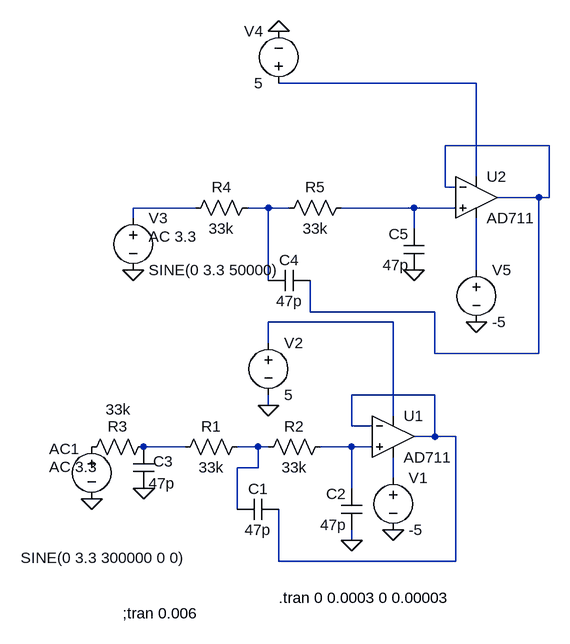
[diagram p0: schematic Sallen Key Filter Sim.asc]
Sallen Key Filter Sim.asc, the LTspice schematic file:
Version 4
SHEET 1 880 680
WIRE 320 -368 16 -368
WIRE 432 -272 272 -272
WIRE 320 -224 320 -368
WIRE 272 -208 272 -272
WIRE 288 -208 272 -208
WIRE 416 -192 352 -192
WIRE 432 -192 432 -272
WIRE 432 -192 416 -192
WIRE -112 -176 -208 -176
WIRE 0 -176 -32 -176
WIRE 32 -176 0 -176
WIRE 224 -176 112 -176
WIRE 288 -176 224 -176
WIRE -208 -160 -208 -176
WIRE 224 -144 224 -176
WIRE 320 -80 320 -160
WIRE 0 -64 0 -176
WIRE 64 -16 64 -64
WIRE 256 -16 64 -16
WIRE 192 0 0 0
WIRE 0 32 0 0
WIRE 256 48 256 -16
WIRE 416 48 416 -192
WIRE 416 48 256 48
WIRE 256 112 128 112
WIRE 0 128 0 112
WIRE 192 144 192 0
WIRE 128 160 128 112
WIRE 160 160 128 160
WIRE 256 176 256 112
WIRE 256 176 224 176
WIRE 288 176 256 176
WIRE -128 192 -192 192
WIRE -16 192 -48 192
WIRE 0 192 -16 192
WIRE 128 192 80 192
WIRE 160 192 128 192
WIRE -16 224 -16 192
WIRE -16 224 -48 224
WIRE 192 240 192 208
WIRE 128 256 128 192
WIRE -48 288 -48 224
WIRE 128 336 128 320
WIRE 16 368 16 288
WIRE 288 368 288 176
WIRE 288 368 16 368
FLAG 128 336 0
FLAG 0 128 0
FLAG 192 320 0
FLAG -192 256 0
FLAG 320 0 0
FLAG 16 -448 0
FLAG -208 -80 0
FLAG 224 -80 0
FLAG -272 272 0
SYMBOL OpAmps\\AD711 192 112 R0
SYMATTR InstName U1
SYMBOL res -32 176 R90
WINDOW 0 0 56 VBottom 2
WINDOW 3 32 56 VTop 2
SYMATTR InstName R1
SYMATTR Value 33k
SYMBOL res 96 176 R90
WINDOW 0 0 56 VBottom 2
WINDOW 3 32 56 VTop 2
SYMATTR InstName R2
SYMATTR Value 33k
SYMBOL cap 16 272 R90
WINDOW 0 0 32 VBottom 2
WINDOW 3 32 32 VTop 2
SYMATTR InstName C1
SYMATTR Value 47p
SYMBOL cap 144 320 R180
WINDOW 0 24 56 Left 2
WINDOW 3 24 8 Left 2
SYMATTR InstName C2
SYMATTR Value 47p
SYMBOL voltage -272 176 R0
WINDOW 123 -65 47 Left 2
WINDOW 39 0 0 Left 0
WINDOW 3 -109 187 Left 2
WINDOW 0 -65 19 Left 2
SYMATTR Value2 AC 3.3
SYMATTR Value SINE(0 3.3 300000 0 0)
SYMATTR InstName AC1
SYMBOL voltage 0 16 R0
WINDOW 123 0 0 Left 0
WINDOW 39 0 0 Left 0
SYMATTR InstName V2
SYMATTR Value 5
SYMBOL voltage 192 224 R0
WINDOW 123 0 0 Left 0
WINDOW 39 0 0 Left 0
SYMATTR InstName V1
SYMATTR Value -5
SYMBOL res -176 176 R90
WINDOW 0 0 56 VBottom 2
WINDOW 3 -57 55 VTop 2
SYMATTR InstName R3
SYMATTR Value 33k
SYMBOL cap -208 192 R0
WINDOW 0 31 22 Left 2
SYMATTR InstName C3
SYMATTR Value 47p
SYMBOL voltage -208 -176 R0
WINDOW 123 24 44 Left 2
WINDOW 39 0 0 Left 0
SYMATTR Value2 AC 3.3
SYMATTR InstName V3
SYMATTR Value SINE(0 3.3 50000)
SYMBOL voltage 16 -352 R180
WINDOW 0 24 96 Left 2
WINDOW 3 24 16 Left 2
WINDOW 123 0 0 Left 0
WINDOW 39 0 0 Left 0
SYMATTR InstName V4
SYMATTR Value 5
SYMBOL res -16 -192 R90
WINDOW 0 0 56 VBottom 2
WINDOW 3 32 56 VTop 2
SYMATTR InstName R4
SYMATTR Value 33k
SYMBOL res 128 -192 R90
WINDOW 0 0 56 VBottom 2
WINDOW 3 32 56 VTop 2
SYMATTR InstName R5
SYMATTR Value 33k
SYMBOL cap 64 -80 R90
WINDOW 0 0 32 VBottom 2
WINDOW 3 32 32 VTop 2
SYMATTR InstName C4
SYMATTR Value 47p
SYMBOL cap 240 -80 R180
WINDOW 0 24 56 Left 2
WINDOW 3 24 8 Left 2
SYMATTR InstName C5
SYMATTR Value 47p
SYMBOL voltage 320 -96 R0
WINDOW 123 0 0 Left 0
WINDOW 39 0 0 Left 0
SYMATTR InstName V5
SYMATTR Value -5
SYMBOL OpAmps\\AD711 320 -256 R0
SYMATTR InstName U2
TEXT 16 424 Left 2 !.tran 0 0.0003 0 0.00003
TEXT -224 448 Left 2 !;tran 0.006

The netlist it stands for:
* Sallen Key Filter Sim.asc
XU1 N011 N008 N007 N012 N008 AD712  ; AD711, pins In+ In- V+ V- OUT
R1 N010 N009 33k
R2 N011 N010 33k
C1 N008 N010 47p
C2 0 N011 47p
V§AC1 P001 0 SINE(0 3.3 300000 0 0) AC 3.3
V2 N007 0 5
V1 N012 0 -5
R3 N009 P001 33k
C3 N009 0 47p
V3 N003 0 SINE(0 3.3 50000) AC 3.3
V4 N001 0 5
R4 N004 N003 33k
R5 N005 N004 33k
C4 N002 N004 47p
C5 0 N005 47p
V5 N006 0 -5
XU2 N005 N002 N001 N006 N002 AD712  ; AD711, pins In+ In- V+ V- OUT
.tran 0 0.0003 0 0.00003
;tran 0.006
.lib ADI1.lib
.backanno
.end